# EAGLE schematic AUDIOMOTH (EAGLE 9.2.1)
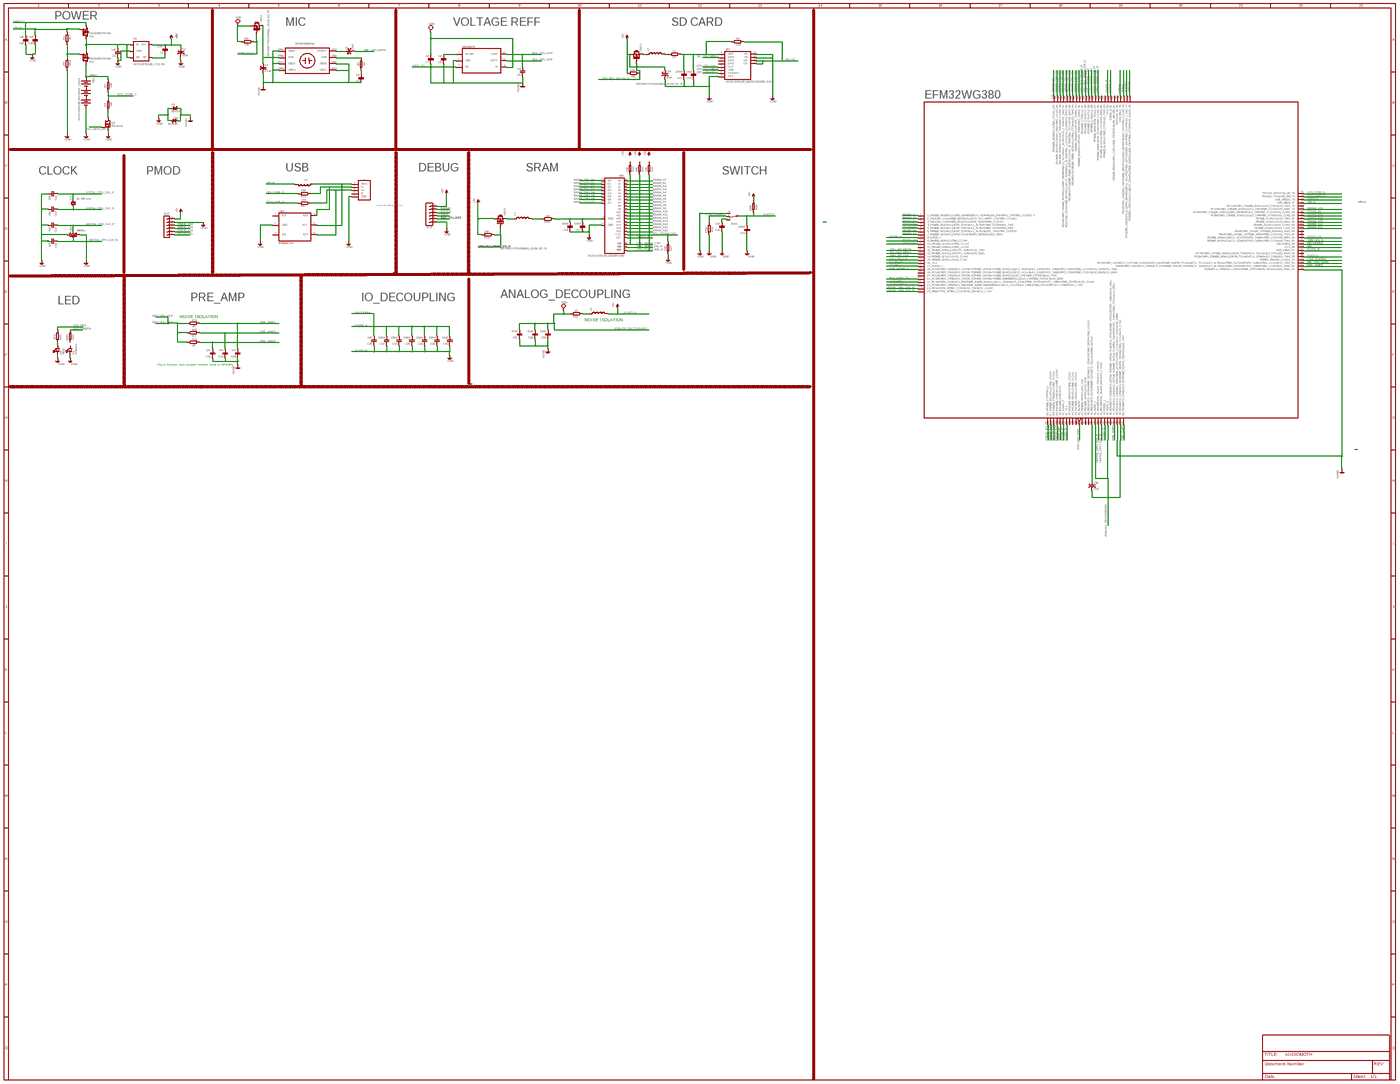
[diagram p0: schematic, sheet 1, overview]
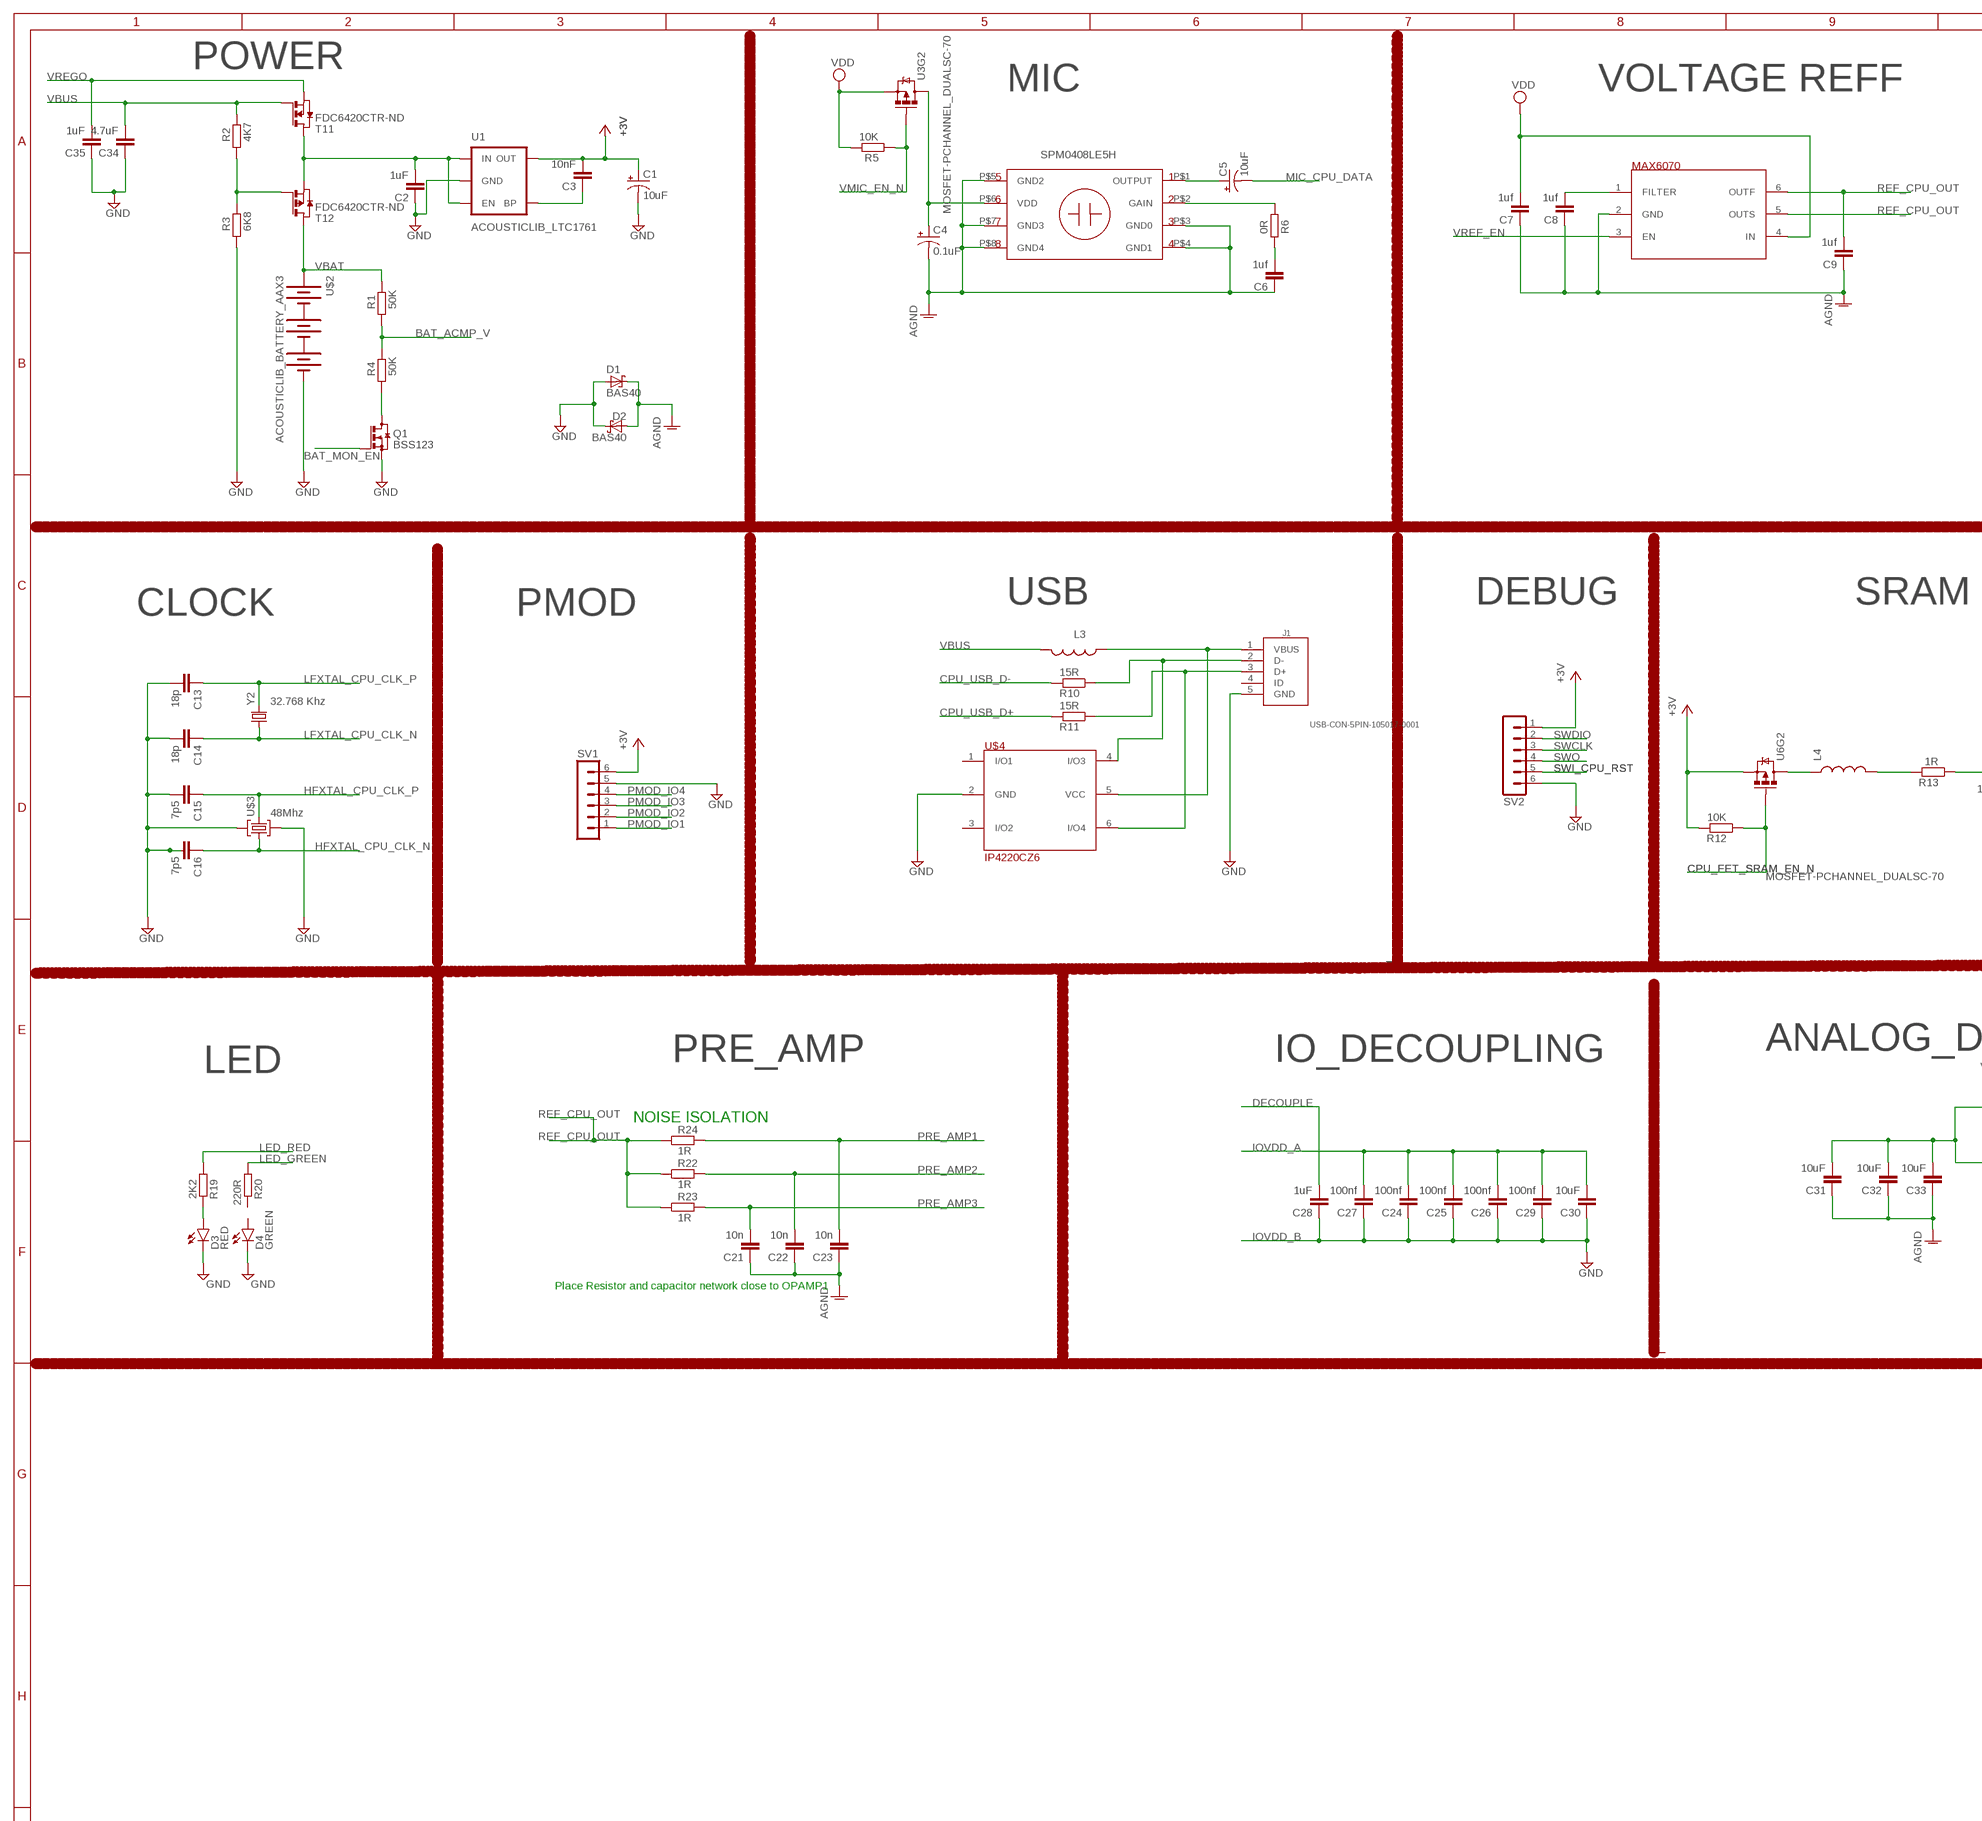
[diagram p1: schematic, sheet 1, part 1 of 6]
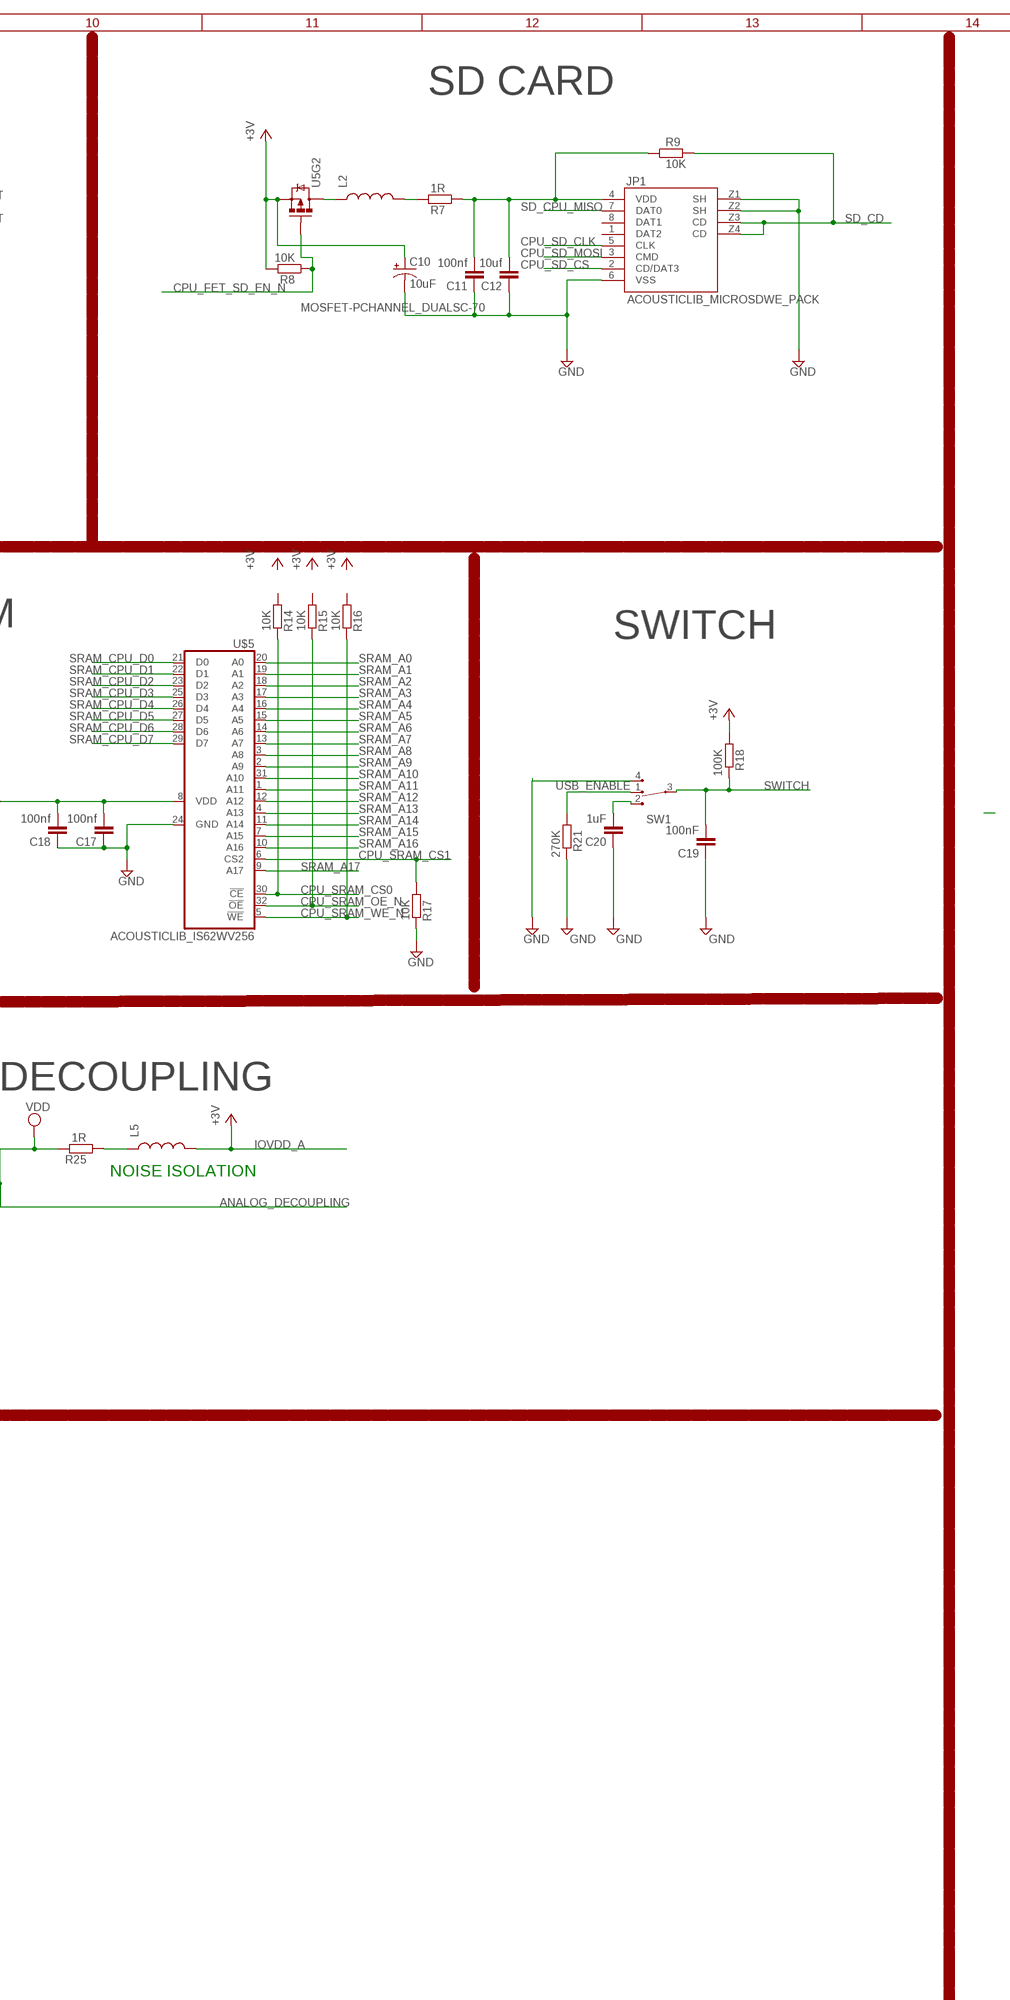
[diagram p2: schematic, sheet 1, part 2 of 6]
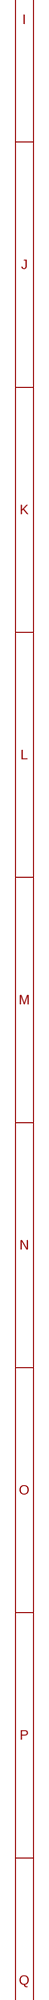
[diagram p3: schematic, sheet 1, part 3 of 6]
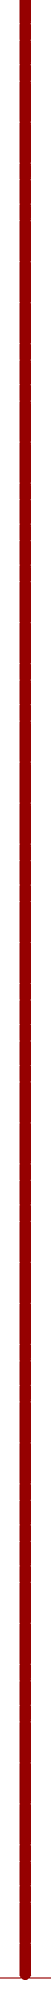
[diagram p4: schematic, sheet 1, part 4 of 6]
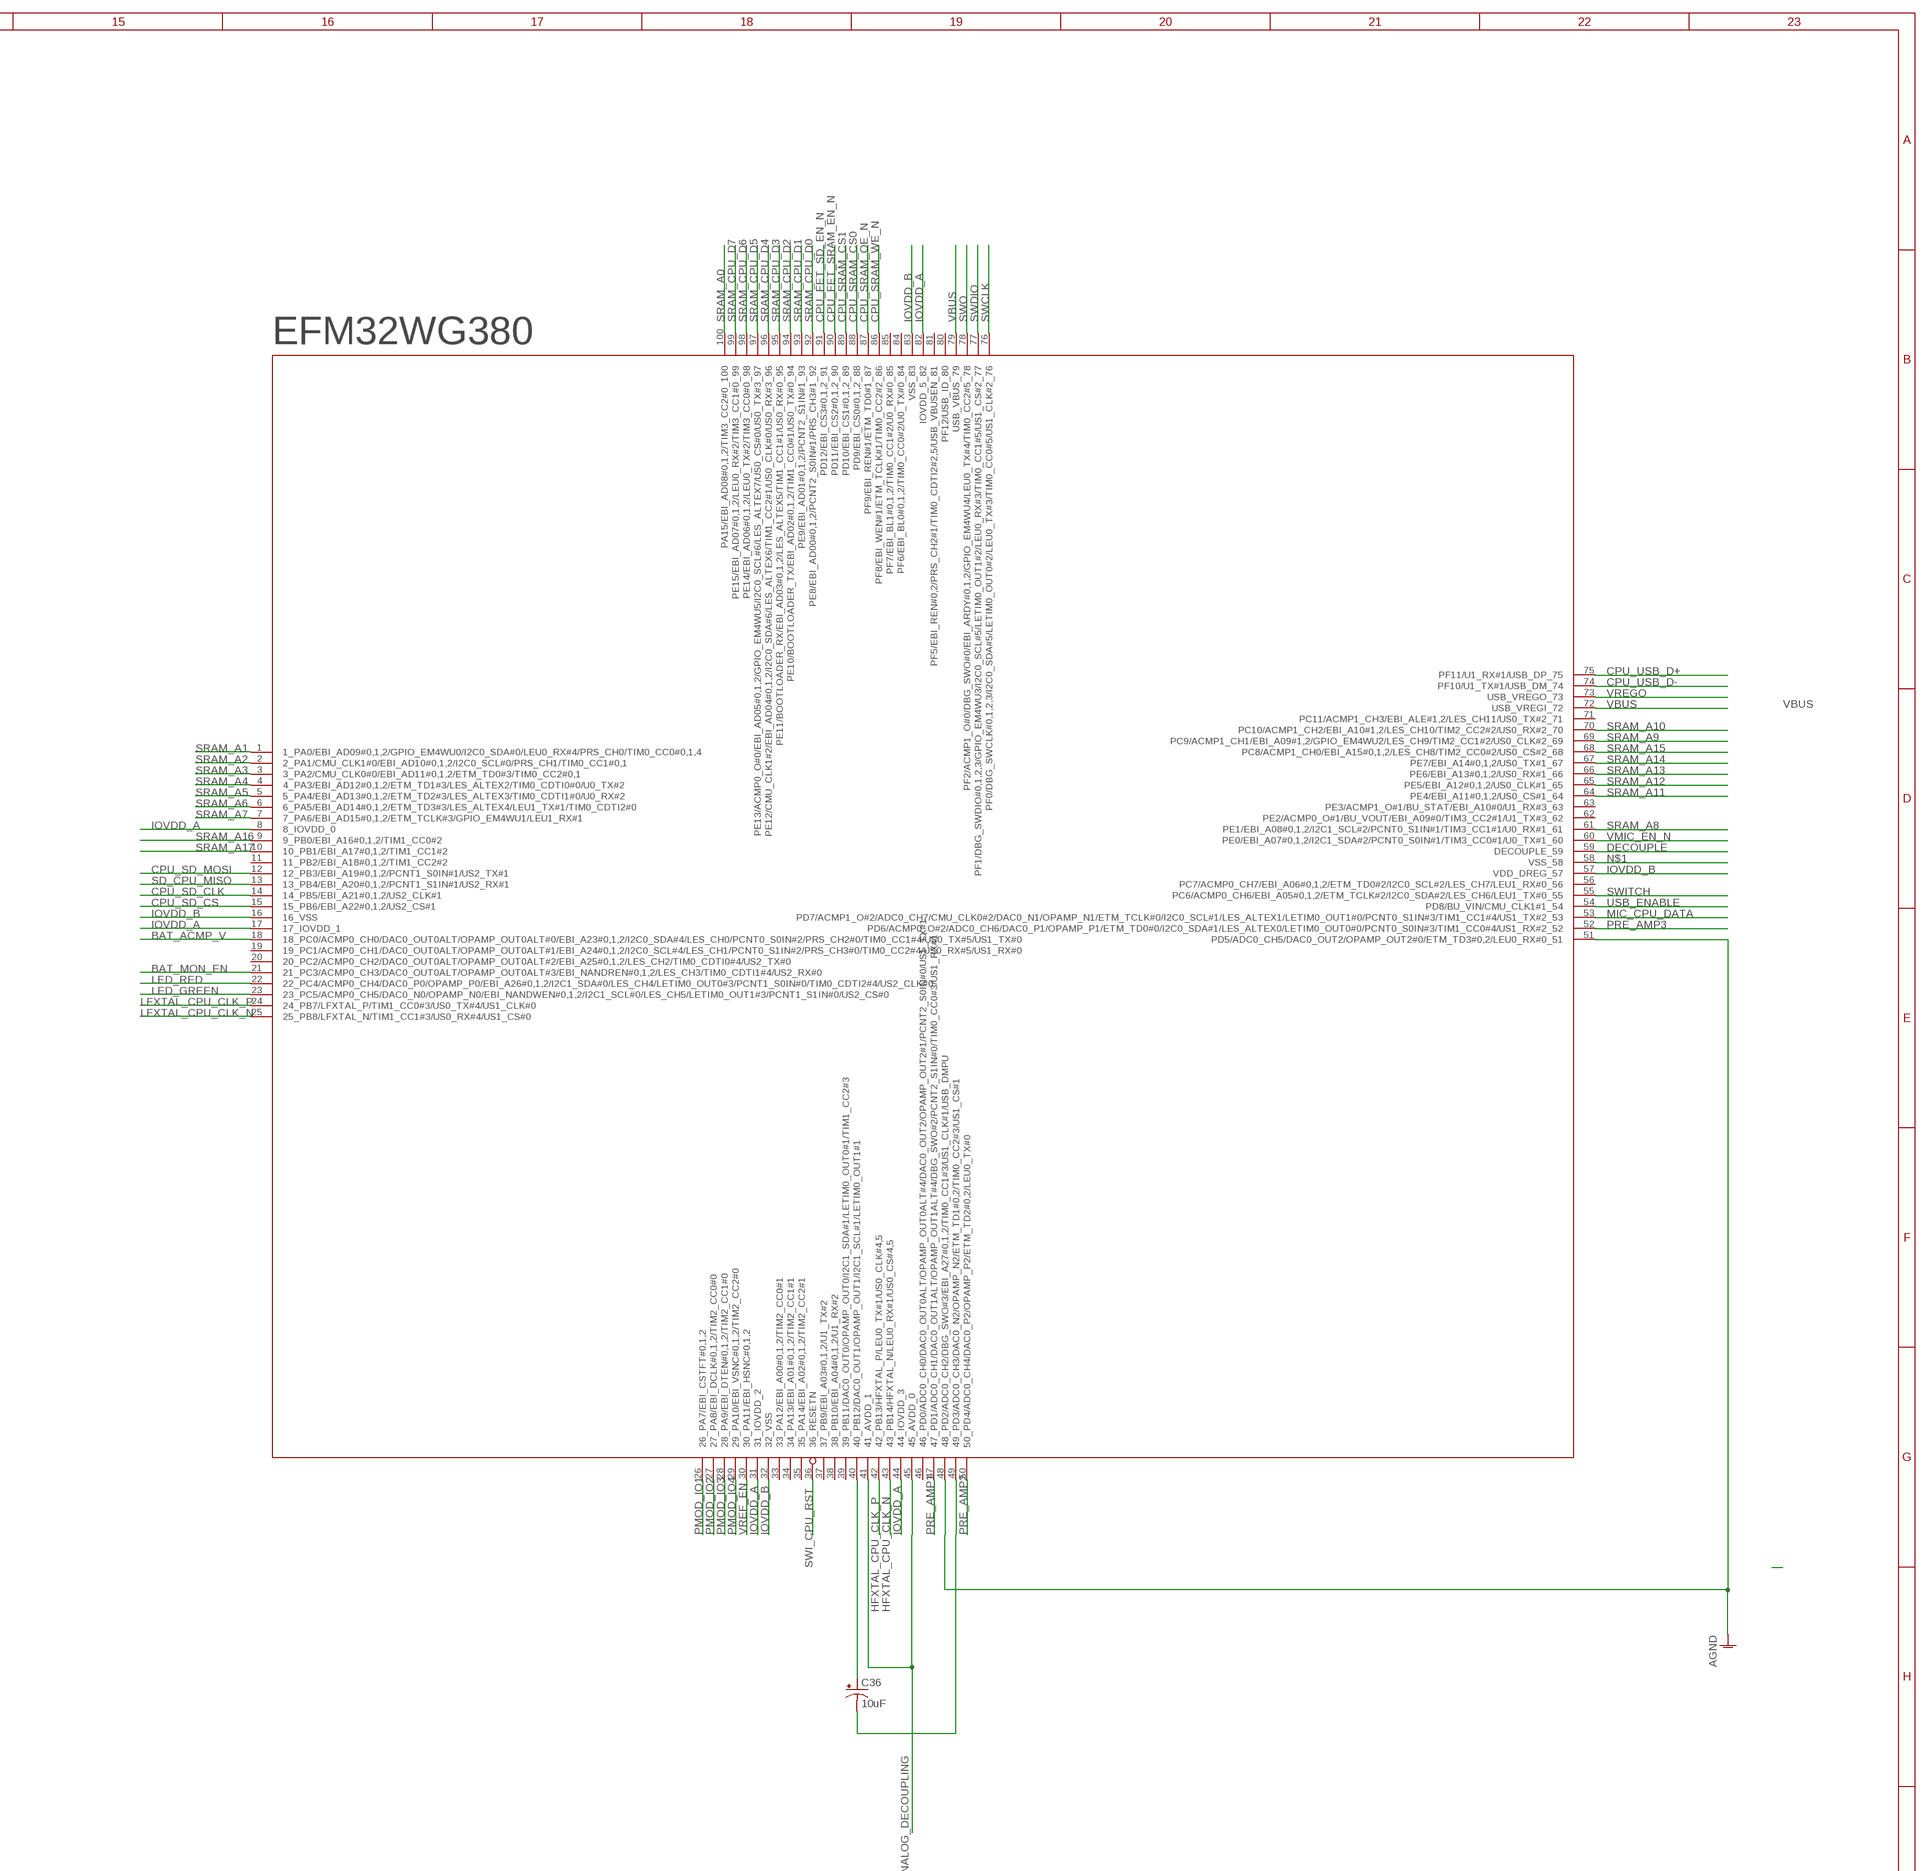
[diagram p5: schematic, sheet 1, part 5 of 6]
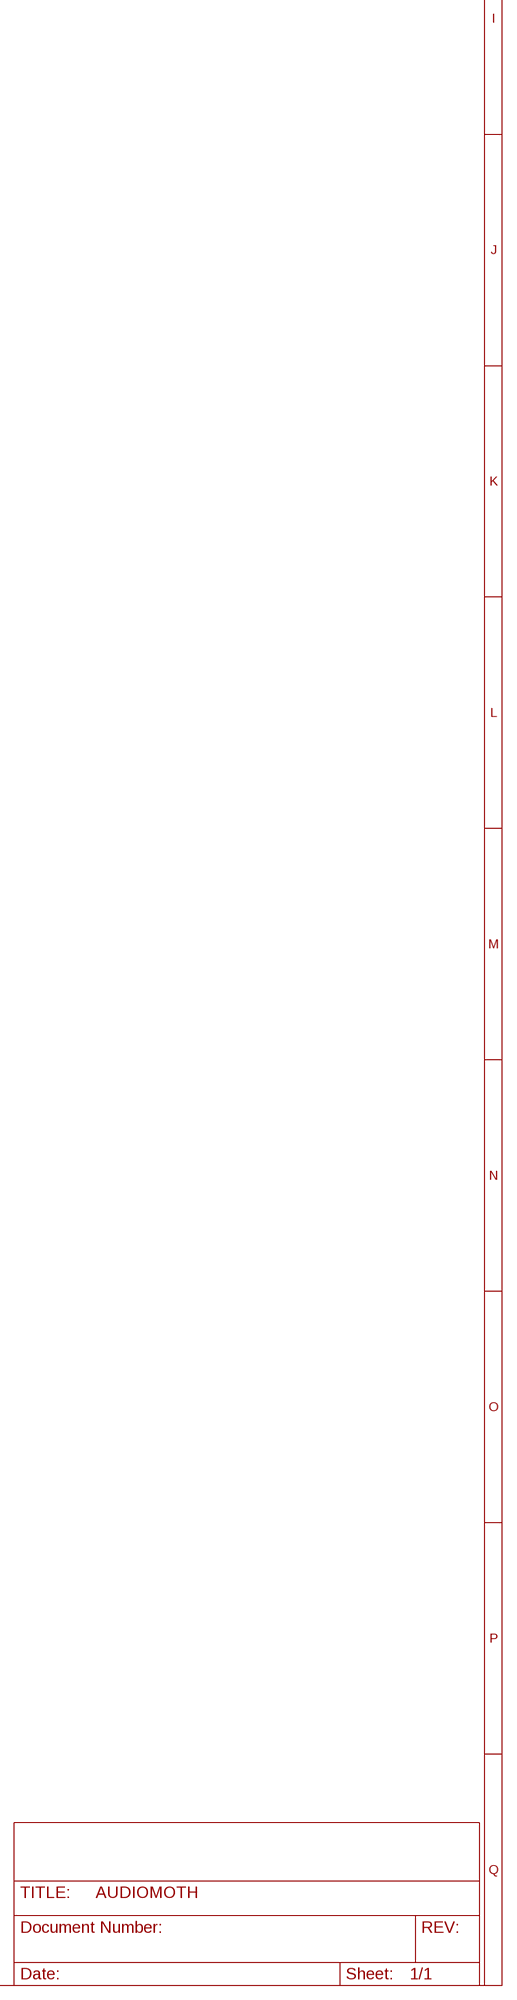
[diagram p6: schematic, sheet 1, part 6 of 6]

## Parts
C1  10uF  SPARKFUN-PASSIVES_CAP_POL1206  [SPARKFUN-PASSIVES_EIA3216]
C2  1uF  SPARKFUN-CAPACITORS_CAP0805  [SPARKFUN-CAPACITORS_0805]
C3  10nF  SPARKFUN-CAPACITORS_CAP0805  [SPARKFUN-CAPACITORS_0805]
C4  0.1uF  SPARKFUN-PASSIVES_CAP_POL1206  [SPARKFUN-PASSIVES_EIA3216]
C5  10uF  SPARKFUN-PASSIVES_CAP_POL1206  [SPARKFUN-PASSIVES_EIA3216]
C6  1uf  SPARKFUN-CAPACITORS_CAP0805  [SPARKFUN-CAPACITORS_0805]
C7  1uf  SPARKFUN-CAPACITORS_CAP0805  [SPARKFUN-CAPACITORS_0805]
C8  1uf  SPARKFUN-CAPACITORS_CAP0805  [SPARKFUN-CAPACITORS_0805]
C9  1uf  SPARKFUN-CAPACITORS_CAP0805  [SPARKFUN-CAPACITORS_0805]
C10  10uF  SPARKFUN-PASSIVES_CAP_POL1206  [SPARKFUN-PASSIVES_EIA3216]
C11  100nf  SPARKFUN-CAPACITORS_CAP0805  [SPARKFUN-CAPACITORS_0805]
C12  10uf  SPARKFUN-CAPACITORS_CAP0805  [SPARKFUN-CAPACITORS_0805]
C13  18p  SPARKFUN-CAPACITORS_CAP0805  [SPARKFUN-CAPACITORS_0805]
C14  18p  SPARKFUN-CAPACITORS_CAP0805  [SPARKFUN-CAPACITORS_0805]
C15  7p5  SPARKFUN-CAPACITORS_CAP0805  [SPARKFUN-CAPACITORS_0805]
C16  7p5  SPARKFUN-CAPACITORS_CAP0805  [SPARKFUN-CAPACITORS_0805]
C17  100nf  SPARKFUN-CAPACITORS_CAP0805  [SPARKFUN-CAPACITORS_0805]
C18  100nf  SPARKFUN-CAPACITORS_CAP0805  [SPARKFUN-CAPACITORS_0805]
C19  100nF  SPARKFUN-CAPACITORS_CAP0805  [SPARKFUN-CAPACITORS_0805]
C20  1uF  SPARKFUN-CAPACITORS_CAP0805  [SPARKFUN-CAPACITORS_0805]
C21  10n  SPARKFUN-CAPACITORS_CAP0805  [SPARKFUN-CAPACITORS_0805]
C22  10n  SPARKFUN-CAPACITORS_CAP0805  [SPARKFUN-CAPACITORS_0805]
C23  10n  SPARKFUN-CAPACITORS_CAP0805  [SPARKFUN-CAPACITORS_0805]
C24  100nf  SPARKFUN-CAPACITORS_CAP0805  [SPARKFUN-CAPACITORS_0805]
C25  100nf  SPARKFUN-CAPACITORS_CAP0805  [SPARKFUN-CAPACITORS_0805]
C26  100nf  SPARKFUN-CAPACITORS_CAP0805  [SPARKFUN-CAPACITORS_0805]
C27  100nf  SPARKFUN-CAPACITORS_CAP0805  [SPARKFUN-CAPACITORS_0805]
C28  1uF  SPARKFUN-CAPACITORS_CAP0805  [SPARKFUN-CAPACITORS_0805]
C29  100nf  SPARKFUN-CAPACITORS_CAP0805  [SPARKFUN-CAPACITORS_0805]
C30  10uF  SPARKFUN-CAPACITORS_CAP0805  [SPARKFUN-CAPACITORS_0805]
C31  10uF  SPARKFUN-CAPACITORS_CAP0805  [SPARKFUN-CAPACITORS_0805]
C32  10uF  SPARKFUN-CAPACITORS_CAP0805  [SPARKFUN-CAPACITORS_0805]
C33  10uF  SPARKFUN-CAPACITORS_CAP0805  [SPARKFUN-CAPACITORS_0805]
C34  4.7uF  SPARKFUN-CAPACITORS_CAP0805  [SPARKFUN-CAPACITORS_0805]
C35  1uF  SPARKFUN-CAPACITORS_CAP0805  [SPARKFUN-CAPACITORS_0805]
C36  10uF  SPARKFUN-PASSIVES_CAP_POL1206  [SPARKFUN-PASSIVES_EIA3216]
D1  BAS40  [SOT23]
D2  BAS40  [SOT23]
D3  RED  SPARKFUN-LED_LED1206  [SPARKFUN-LED_LED-1206]
D4  GREEN  SPARKFUN-LED_LED1206  [SPARKFUN-LED_LED-1206]
J1  USB-CON-5PIN-105017-0001  GEEKAMMO_USB-CON-5PIN-105017-0001  [GEEKAMMO_USB-MICRO-MOLEX-105017-0001]
JP1  ACOUSTICLIB_MICROSDWE_PACK  [ACOUSTICLIB_693071010811]
L2  SPARKFUN-PASSIVES_INDUCTOR0805  [SPARKFUN-PASSIVES_0805]
L3  SPARKFUN-PASSIVES_INDUCTOR0805  [SPARKFUN-PASSIVES_0805]
L4  SPARKFUN-PASSIVES_INDUCTOR0805  [SPARKFUN-PASSIVES_0805]
L5  SPARKFUN-PASSIVES_INDUCTOR0805  [SPARKFUN-PASSIVES_0805]
Q1  BSS123  [SOT23]
R1  50K  R-EU_M0805  [M0805]
R2  4K7  R-EU_M0805  [M0805]
R3  6K8  R-EU_M0805  [M0805]
R4  50K  R-EU_M0805  [M0805]
R5  10K  R-EU_M0805  [M0805]
R6  0R  R-EU_M0805  [M0805]
R7  1R  R-EU_M0805  [M0805]
R8  10K  R-EU_M0805  [M0805]
R9  10K  R-EU_M0805  [M0805]
R10  15R  R-EU_M0805  [M0805]
R11  15R  R-EU_M0805  [M0805]
R12  10K  R-EU_M0805  [M0805]
R13  1R  R-EU_M0805  [M0805]
R14  10K  R-EU_M0805  [M0805]
R15  10K  R-EU_M0805  [M0805]
R16  10K  R-EU_M0805  [M0805]
R17  10K  R-EU_M0805  [M0805]
R18  100K  R-EU_M0805  [M0805]
R19  2K2  R-EU_M0805  [M0805]
R20  220R  R-EU_M0805  [M0805]
R21  270K  R-EU_M0805  [M0805]
R22  1R  R-EU_M0805  [M0805]
R23  1R  R-EU_M0805  [M0805]
R24  1R  R-EU_M0805  [M0805]
R25  1R  R-EU_M0805  [M0805]
SV1  ACOUSTICLIB_MA06-1RIGHT_ANGLE  [ACOUSTICLIB_MA06-1W]
SV2  ACOUSTICLIB_MA06-1RIGHT_ANGLE  [ACOUSTICLIB_MA06-1W]
SW1  CT10-XXXX-CSS131  [CT10-XXXX-G4]
T1  FDC6420CTR-ND  ZETEX_PN_MOSFET-  [ZETEX_SOT23-6]
U1  ACOUSTICLIB_LTC1761  [ACOUSTICLIB_SOT23-5]
U2  ACOUSTICLIB_SPM0408LE5H  [ACOUSTICLIB_SPM0408LE5H-TB]
U3  MOSFET-PCHANNEL_DUALSC-70  ACOUSTICLIB_MOSFET-PCHANNEL_DUALSC-70  [ACOUSTICLIB_SC-70]
U4  ACOUSTICLIB_MAX6070SOT23  [ACOUSTICLIB_SOT26]
U5  MOSFET-PCHANNEL_DUALSC-70  ACOUSTICLIB_MOSFET-PCHANNEL_DUALSC-70  [ACOUSTICLIB_SC-70]
U6  MOSFET-PCHANNEL_DUALSC-70  ACOUSTICLIB_MOSFET-PCHANNEL_DUALSC-70  [ACOUSTICLIB_SC-70]
U$1  EFM32_QGP100  [EFM32_QFP100]
U$2  ACOUSTICLIB_BATTERY_AAX3  [ACOUSTICLIB_BATTERY-AAX3]
U$3  ACOUSTICLIB_XRCGB48M000F4M00R0  [ACOUSTICLIB_XRCGB48M000F4M00R0]
U$4  ACOUSTICLIB_IP4220CZ6  [ACOUSTICLIB_SC-74]
U$5  ACOUSTICLIB_IS62WV256  [ACOUSTICLIB_IS62WV256]
Y2  ACOUSTICLIB_CRYSTALEPSONMC146  [ACOUSTICLIB_CRYSTAL-32KHZ-SMD_EPSON_MC146]

## Nets
+3V2: C1.A(+) C3.2 C10.A(+) R8.2 U1.5(OUT) U5.4(S)
+3V3: R12.2 R18.1 SV1.6 SV2.1 U6.4(S)
AGND: C4.C(-) C6.1 C7.1 C8.1 C9.1 C21.1 C22.1 C23.1 C31.1 C32.1 C33.1 D1.3(C) D2.1(A) U2.P$3(GND0) U2.P$4(GND1) U2.P$5(GND2) U2.P$7(GND3) U2.P$8(GND4) U4.2(GND) U$1.48(48_PD2/ADC0_CH2/DBG_SWO#3/EBI_A27#0,1,2/TIM0_CC1#3/US1_CLK#1/USB_DMPU) U$1.51(PD5/ADC0_CH5/DAC0_OUT2/OPAMP_OUT2#0/ETM_TD3#0,2/LEU0_RX#0_51)
ANALOG_DECOUPLING: C31.2 C32.2 C33.2 R25.2 U$1.41(41_AVDD_1) U$1.45(45_AVDD_0) ; supply symbol labelled VDD
BAT_ACMP_V: R1.1 R4.2 U$1.18(18_PC0/ACMP0_CH0/DAC0_OUT0ALT/OPAMP_OUT0ALT#0/EBI_A23#0,1,2/I2C0_SDA#4/LES_CH0/PCNT0_S0IN#2/PRS_CH2#0/TIM0_CC1#4/US0_TX#5/US1_TX#0)
BAT_MON_EN: Q1.1(G) U$1.21(21_PC3/ACMP0_CH3/DAC0_OUT0ALT/OPAMP_OUT0ALT#3/EBI_NANDREN#0,1,2/LES_CH3/TIM0_CDTI1#4/US2_RX#0)
CPU_FET_SD_EN_N: R8.1 U5.5(G) U$1.91(PD12/EBI_CS3#0,1,2_91)
CPU_FET_SRAM_EN_N: R12.1 U6.5(G) U$1.90(PD11/EBI_CS2#0,1,2_90)
CPU_SD_CLK: JP1.5(CLK) U$1.14(14_PB5/EBI_A21#0,1,2/US2_CLK#1)
CPU_SD_CS: JP1.2(CD/DAT3) U$1.15(15_PB6/EBI_A22#0,1,2/US2_CS#1)
CPU_SD_MOSI: JP1.3(CMD) U$1.12(12_PB3/EBI_A19#0,1,2/PCNT1_S0IN#1/US2_TX#1)
CPU_SRAM_CS0: R14.2 U$1.88(PD9/EBI_CS0#0,1,2_88) U$5.30(!CE)
CPU_SRAM_CS1: R17.1 U$1.89(PD10/EBI_CS1#0,1,2_89) U$5.6(CS2)
CPU_SRAM_OE_N: R15.2 U$1.87(PF9/EBI_REN#1/ETM_TD0#1_87) U$5.32(!OE)
CPU_SRAM_WE_N: R16.2 U$1.86(PF8/EBI_WEN#1/ETM_TCLK#1/TIM0_CC2#2_86) U$5.5(!WE)
CPU_USB_D+: R11.2 U$1.75(PF11/U1_RX#1/USB_DP_75)
CPU_USB_D-: R10.2 U$1.74(PF10/U1_TX#1/USB_DM_74)
DECOUPLE: C28.2 U$1.59(DECOUPLE_59)
GND: C1.C(-) C2.1 C10.C(-) C11.1 C12.1 C13.2 C14.2 C15.2 C16.2 C17.1 C18.1 C19.1 C20.1 C34.1 C35.1 D1.1(A) D2.3(C) D3.C D4.C J1.5(GND) JP1.6(VSS) JP1.Z1(SH) JP1.Z2(SH) Q1.2(S) R3.1 R17.2 R21.2 SV1.5 SV2.6 SW1.4 U1.2(GND) U$2.GND@2(-) U$3.P$2 U$3.P$4 U$4.2(GND) U$5.24(GND)
HFXTAL_CPU_CLK_N: C16.1 U$1.43(43_PB14/HFXTAL_N/LEU0_RX#1/US0_CS#4,5) U$3.P$1
HFXTAL_CPU_CLK_P: C15.1 U$1.42(42_PB13/HFXTAL_P/LEU0_TX#1/US0_CLK#4,5) U$3.P$3
IOVDD_A: C24.2 C25.2 C26.2 C27.2 C29.2 C30.2 L5.2 U$1.8(8_IOVDD_0) U$1.17(17_IOVDD_1) U$1.31(31_IOVDD_2) U$1.44(44_IOVDD_3) U$1.82(IOVDD_5_82)
IOVDD_B: C24.1 C25.1 C26.1 C27.1 C28.1 C29.1 C30.1 U$1.16(16_VSS) U$1.32(32_VSS) U$1.57(VDD_DREG_57) U$1.83(VSS_83) ; supply symbol labelled GND
LED_GREEN: R20.1 U$1.23(23_PC5/ACMP0_CH5/DAC0_N0/OPAMP_N0/EBI_NANDWEN#0,1,2/I2C1_SCL#0/LES_CH5/LETIM0_OUT1#3/PCNT1_S1IN#0/US2_CS#0)
LED_RED: R19.1 U$1.22(22_PC4/ACMP0_CH4/DAC0_P0/OPAMP_P0/EBI_A26#0,1,2/I2C1_SDA#0/LES_CH4/LETIM0_OUT0#3/PCNT1_S0IN#0/TIM0_CDTI2#4/US2_CLK#0)
LFXTAL_CPU_CLK_N: C14.1 U$1.25(25_PB8/LFXTAL_N/TIM1_CC1#3/US0_RX#4/US1_CS#0) Y2.P$2
LFXTAL_CPU_CLK_P: C13.1 U$1.24(24_PB7/LFXTAL_P/TIM1_CC0#3/US0_TX#4/US1_CLK#0) Y2.P$1
MIC_CPU_DATA: C5.C(-) U$1.53(PD7/ACMP1_O#2/ADC0_CH7/CMU_CLK0#2/DAC0_N1/OPAMP_N1/ETM_TCLK#0/I2C0_SCL#1/LES_ALTEX1/LETIM0_OUT1#0/PCNT0_S1IN#3/TIM1_CC1#4/US1_TX#2_53)
N$1: U$1.58(VSS_58)
N$3: R2.1 R3.2 T1.3(2:G)
N$4: C2.2 T1.2(2:S) T1.6(1:D) U1.1(IN) U1.3(EN)
N$6: C3.1 U1.4(BP)
N$7: Q1.3(D) R4.1
N$10: C4.A(+) U2.P$6(VDD) U3.3(D)
N$11: C5.A(+) U2.P$1(OUTPUT)
N$13: R6.1 U2.P$2(GAIN)
N$14: C6.2 R6.2
N$16: C8.2 U4.1(FILTER)
N$20: L2.1 U5.3(D)
N$28: L2.2 R7.2
N$29: C11.2 C12.2 JP1.4(VDD) R7.1 R9.1
N$36: J1.1(VBUS) L3.1 U$4.5(VCC)
N$38: J1.2(D-) R10.1 U$4.4(I/O3)
N$40: J1.3(D+) R11.1 U$4.6(I/O4)
N$76: D3.A R19.2
N$78: L4.1 U6.3(D)
N$79: L4.2 R13.2
N$80: C17.2 C18.2 R13.1 U$5.8(VDD)
N$85: C20.2 SW1.2
N$91: L5.1 R25.1
N$109: C36.C(-) U$1.49(49_PD3/ADC0_CH3/DAC0_N2/OPAMP_N2/ETM_TD1#0,2/TIM0_CC2#3/US1_CS#1)
OPAMP1_OPAMP2_DATA: C36.A(+) U$1.40(40_PB12/DAC0_OUT1/OPAMP_OUT1/I2C1_SCL#1/LETIM0_OUT1#1)
PMOD_IO1: SV1.1 U$1.26(26_PA7/EBI_CSTFT#0,1,2)
PMOD_IO2: SV1.2 U$1.27(27_PA8/EBI_DCLK#0,1,2/TIM2_CC0#0)
PMOD_IO3: SV1.3 U$1.28(28_PA9/EBI_DTEN#0,1,2/TIM2_CC1#0)
PMOD_IO4: SV1.4 U$1.29(29_PA10/EBI_VSNC#0,1,2/TIM2_CC2#0)
PRE_AMP1: C23.2 R24.2 U$1.47(47_PD1/ADC0_CH1/DAC0_OUT1ALT/OPAMP_OUT1ALT#4/DBG_SWO#2/PCNT2_S1IN#0/TIM0_CC0#3/US1_RX#1)
PRE_AMP2: C22.2 R22.2 U$1.50(50_PD4/ADC0_CH4/DAC0_P2/OPAMP_P2/ETM_TD2#0,2/LEU0_TX#0)
PRE_AMP3: C21.2 R23.2 U$1.52(PD6/ACMP0_O#2/ADC0_CH6/DAC0_P1/OPAMP_P1/ETM_TD0#0/I2C0_SDA#1/LES_ALTEX0/LETIM0_OUT0#0/PCNT0_S0IN#3/TIM1_CC0#4/US1_RX#2_52)
REF_CPU_OUT: C9.2 R22.1 R23.1 R24.1 U4.5(OUTS) U4.6(OUTF)
SD_CD: JP1.Z3(CD) JP1.Z4(CD) R9.2
SD_CPU_MISO: JP1.7(DAT0) U$1.13(13_PB4/EBI_A20#0,1,2/PCNT1_S1IN#1/US2_RX#1)
SRAM_A0: U$1.100(PA15/EBI_AD08#0,1,2/TIM3_CC2#0_100) U$5.20(A0)
SRAM_A1: U$1.1(1_PA0/EBI_AD09#0,1,2/GPIO_EM4WU0/I2C0_SDA#0/LEU0_RX#4/PRS_CH0/TIM0_CC0#0,1,4) U$5.19(A1)
SRAM_A2: U$1.2(2_PA1/CMU_CLK1#0/EBI_AD10#0,1,2/I2C0_SCL#0/PRS_CH1/TIM0_CC1#0,1) U$5.18(A2)
SRAM_A3: U$1.3(3_PA2/CMU_CLK0#0/EBI_AD11#0,1,2/ETM_TD0#3/TIM0_CC2#0,1) U$5.17(A3)
SRAM_A4: U$1.4(4_PA3/EBI_AD12#0,1,2/ETM_TD1#3/LES_ALTEX2/TIM0_CDTI0#0/U0_TX#2) U$5.16(A4)
SRAM_A5: U$1.5(5_PA4/EBI_AD13#0,1,2/ETM_TD2#3/LES_ALTEX3/TIM0_CDTI1#0/U0_RX#2) U$5.15(A5)
SRAM_A6: U$1.6(6_PA5/EBI_AD14#0,1,2/ETM_TD3#3/LES_ALTEX4/LEU1_TX#1/TIM0_CDTI2#0) U$5.14(A6)
SRAM_A7: U$1.7(7_PA6/EBI_AD15#0,1,2/ETM_TCLK#3/GPIO_EM4WU1/LEU1_RX#1) U$5.13(A7)
SRAM_A8: U$1.61(PE1/EBI_A08#0,1,2/I2C1_SCL#2/PCNT0_S1IN#1/TIM3_CC1#1/U0_RX#1_61) U$5.3(A8)
SRAM_A9: U$1.69(PC9/ACMP1_CH1/EBI_A09#1,2/GPIO_EM4WU2/LES_CH9/TIM2_CC1#2/US0_CLK#2_69) U$5.2(A9)
SRAM_A10: U$1.70(PC10/ACMP1_CH2/EBI_A10#1,2/LES_CH10/TIM2_CC2#2/US0_RX#2_70) U$5.31(A10)
SRAM_A11: U$1.64(PE4/EBI_A11#0,1,2/US0_CS#1_64) U$5.1(A11)
SRAM_A12: U$1.65(PE5/EBI_A12#0,1,2/US0_CLK#1_65) U$5.12(A12)
SRAM_A13: U$1.66(PE6/EBI_A13#0,1,2/US0_RX#1_66) U$5.4(A13)
SRAM_A14: U$1.67(PE7/EBI_A14#0,1,2/US0_TX#1_67) U$5.11(A14)
SRAM_A15: U$1.68(PC8/ACMP1_CH0/EBI_A15#0,1,2/LES_CH8/TIM2_CC0#2/US0_CS#2_68) U$5.7(A15)
SRAM_A16: U$1.9(9_PB0/EBI_A16#0,1,2/TIM1_CC0#2) U$5.10(A16)
SRAM_A17: U$1.10(10_PB1/EBI_A17#0,1,2/TIM1_CC1#2) U$5.9(A17)
SRAM_CPU_D0: U$1.92(PE8/EBI_AD00#0,1,2/PCNT2_S0IN#1/PRS_CH3#1_92) U$5.21(D0)
SRAM_CPU_D1: U$1.93(PE9/EBI_AD01#0,1,2/PCNT2_S1IN#1_93) U$5.22(D1)
SRAM_CPU_D2: U$1.94(PE10/BOOTLOADER_TX/EBI_AD02#0,1,2/TIM1_CC0#1/US0_TX#0_94) U$5.23(D2)
SRAM_CPU_D3: U$1.95(PE11/BOOTLOADER_RX/EBI_AD03#0,1,2/LES_ALTEX5/TIM1_CC1#1/US0_RX#0_95) U$5.25(D3)
SRAM_CPU_D4: U$1.96(PE12/CMU_CLK1#2/EBI_AD04#0,1,2/I2C0_SDA#6/LES_ALTEX6/TIM1_CC2#1/US0_CLK#0/US0_RX#3_96) U$5.26(D4)
SRAM_CPU_D5: U$1.97(PE13/ACMP0_O#0/EBI_AD05#0,1,2/GPIO_EM4WU5/I2C0_SCL#6/LES_ALTEX7/US0_CS#0/US0_TX#3_97) U$5.27(D5)
SRAM_CPU_D6: U$1.98(PE14/EBI_AD06#0,1,2/LEU0_TX#2/TIM3_CC0#0_98) U$5.28(D6)
SRAM_CPU_D7: U$1.99(PE15/EBI_AD07#0,1,2/LEU0_RX#2/TIM3_CC1#0_99) U$5.29(D7)
SWCLK: SV2.3 U$1.76(PF0/DBG_SWCLK#0,1,2,3/I2C0_SDA#5/LETIM0_OUT0#2/LEU0_TX#3/TIM0_CC0#5/US1_CLK#2_76)
SWDIO: SV2.2 U$1.77(PF1/DBG_SWDIO#0,1,2,3/GPIO_EM4WU3/I2C0_SCL#5/LETIM0_OUT1#2/LEU0_RX#3/TIM0_CC1#5/US1_CS#2_77)
SWI_CPU_RST: SV2.5 U$1.36(36_RESETN)
SWITCH: C19.2 R18.2 SW1.3 U$1.55(PC6/ACMP0_CH6/EBI_A05#0,1,2/ETM_TCLK#2/I2C0_SDA#2/LES_CH6/LEU1_TX#0_55)
SWO: SV2.4 U$1.78(PF2/ACMP1_O#0/DBG_SWO#0/EBI_ARDY#0,1,2/GPIO_EM4WU4/LEU0_TX#4/TIM0_CC2#5_78)
USB_ENABLE: R21.1 SW1.1 U$1.54(PD8/BU_VIN/CMU_CLK1#1_54)
VBAT: R1.2 T1.4(2:D) U$2.PWR@1(+)
VBUS: C34.2 L3.2 R2.2 T1.1(1:G) U$1.72(USB_VREGI_72) U$1.79(USB_VBUS_79)
VDD: C7.2 R5.2 U3.4(S) U4.4(IN)
VMIC_EN_N: R5.1 U3.5(G) U$1.60(PE0/EBI_A07#0,1,2/I2C1_SDA#2/PCNT0_S0IN#1/TIM3_CC0#1/U0_TX#1_60)
VREF_EN: U4.3(EN) U$1.30(30_PA11/EBI_HSNC#0,1,2)
VREGO: C35.2 T1.5(1:S) U$1.73(USB_VREGO_73)
Unconnected: D4.A J1.4(ID) JP1.1(DAT2) JP1.8(DAT1) R14.1 R15.1 R16.1 R20.2 U3.1(S) U3.2(G) U3.6(D) U5.1(S) U5.2(G) U5.6(D) U6.1(S) U6.2(G) U6.6(D) U$1.11(11_PB2/EBI_A18#0,1,2/TIM1_CC2#2) U$1.19(19_PC1/ACMP0_CH1/DAC0_OUT0ALT/OPAMP_OUT0ALT#1/EBI_A24#0,1,2/I2C0_SCL#4/LES_CH1/PCNT0_S1IN#2/PRS_CH3#0/TIM0_CC2#4/US0_RX#5/US1_RX#0) U$1.20(20_PC2/ACMP0_CH2/DAC0_OUT0ALT/OPAMP_OUT0ALT#2/EBI_A25#0,1,2/LES_CH2/TIM0_CDTI0#4/US2_TX#0) U$1.33(33_PA12/EBI_A00#0,1,2/TIM2_CC0#1) U$1.34(34_PA13/EBI_A01#0,1,2/TIM2_CC1#1) U$1.35(35_PA14/EBI_A02#0,1,2/TIM2_CC2#1) U$1.37(37_PB9/EBI_A03#0,1,2/U1_TX#2) U$1.38(38_PB10/EBI_A04#0,1,2/U1_RX#2) U$1.39(39_PB11/DAC0_OUT0/OPAMP_OUT0/I2C1_SDA#1/LETIM0_OUT0#1/TIM1_CC2#3) U$1.46(46_PD0/ADC0_CH0/DAC0_OUT0ALT/OPAMP_OUT0ALT#4/DAC0_OUT2/OPAMP_OUT2#1/PCNT2_S0IN#0/US1_TX#1) U$1.56(PC7/ACMP0_CH7/EBI_A06#0,1,2/ETM_TD0#2/I2C0_SCL#2/LES_CH7/LEU1_RX#0_56) U$1.62(PE2/ACMP0_O#1/BU_VOUT/EBI_A09#0/TIM3_CC2#1/U1_TX#3_62) U$1.63(PE3/ACMP1_O#1/BU_STAT/EBI_A10#0/U1_RX#3_63) U$1.71(PC11/ACMP1_CH3/EBI_ALE#1,2/LES_CH11/US0_TX#2_71) U$1.80(PF12/USB_ID_80) U$1.81(PF5/EBI_REN#0,2/PRS_CH2#1/TIM0_CDTI2#2,5/USB_VBUSEN_81) U$1.84(PF6/EBI_BL0#0,1,2/TIM0_CC0#2/U0_TX#0_84) U$1.85(PF7/EBI_BL1#0,1,2/TIM0_CC1#2/U0_RX#0_85) U$4.1(I/O1) U$4.3(I/O2)

## Notes on the sheet
- POWER
- MIC | VOLTAGE REFF | SD CARD
- +3V | +3V | +3V
- SPM0408LE5H
- +3V | +3V | +3V
- CLOCK | PMOD | USB | DEBUG | SRAM | SWITCH
- +3V
- +3V
- 32.768 Khz
- +3V
- +3V
- 48Mhz
- PRE_AMP | IO_DECOUPLING | ANALOG_DECOUPLING
- LED
- +3V
- NOISE ISOLATION
- NOISE ISOLATION
- Place Resistor and capacitor network close to OPAMP1

## Library data of the parts
C1 C4 C5 C10 C36 = AudioMoth - Copy:SPARKFUN-PASSIVES_CAP_POL: Capacitor Polarized These are standard SMD and PTH capacitors. Normally 10uF, 47uF, and 100uF in electrolytic and tantalum varieties. Always verify the external diameter of the through hole cap, it varies with capacity, voltage, and manufacturer. The EIA devices should be standard.
C2 C3 C6-C9 C11-C35 = AudioMoth - Copy:SPARKFUN-CAPACITORS_CAP: Capacitor Standard 0603 ceramic capacitor, and 0.1" leaded capacitor.
D1 D2 = diode:BAS40: Silicon Schottky Diodes General-purpose diode for high-speed switching
D3 D4 = AudioMoth - Copy:SPARKFUN-LED_LED: LEDs Standard schematic elements and footprints for 5mm, 3mm, 1206, and 0603 sized LEDs. 5mm - Spark Fun Electronics SKU : COM-00529 (and others)
J1 = AudioMoth - Copy:GEEKAMMO_USB-CON-5PIN: Molex Micro USB 105017-0001
JP1 = AudioMoth - Copy:ACOUSTICLIB_MICROSD
L2-L5 = AudioMoth - Copy:SPARKFUN-PASSIVES_INDUCTOR: Inductors Basic Inductor/Choke - 0603 and 1206. Footprints are not proven and vary greatly between part numbers. INDUCTOR POWER 3.3UH 4.0A SMD 0.197" L x 0.197" W x 0.177" H (5.00mm x 5.00mm x 4.50mm)
Q1 = transistor-small-signal:BSS123: N-CHANNEL MOS FET
R1-R25 = rcl:R-EU_: RESISTOR, European symbol; SPICEPREFIX: R
SV1 SV2 = AudioMoth - Copy:ACOUSTICLIB_MA06-1: PIN HEADER
SW1 = switch-coto:CT10-XXXX-: CT10 Series Molded Switch Source: www.cotorelay.com .. Coto_Technology__CT10-1530-G1.pdf
T1 = AudioMoth - Copy:ZETEX_PN_MOSFET-: DUAL N AND P-CHANNEL ENHANCEMENT MODE MOSFET Source: Data sheet <http://www.farnell.com/datasheets/1693880.pdf>
U1 = AudioMoth - Copy:ACOUSTICLIB_LTC1761
U2 = AudioMoth - Copy:ACOUSTICLIB_SPM0408LE5H
U3 U5 U6 = AudioMoth - Copy:ACOUSTICLIB_MOSFET-PCHANNEL_DUAL
U4 = AudioMoth - Copy:ACOUSTICLIB_MAX6070
U$1 = AudioMoth - Copy:EFM32_QGP100
U$2 = AudioMoth - Copy:ACOUSTICLIB_BATTERY_AAX3
U$3 = AudioMoth - Copy:ACOUSTICLIB_XRCGB48M000F4M00R0: XRCGB48M000F4M00R0 48MHz Clock
U$4 = AudioMoth - Copy:ACOUSTICLIB_IP4220CZ6: IP4220CZ6 The IP4220CZ6 is designed to protect I/O lines sensitive to capacitive load, such as USB 2.0 http://www.farnell.com/datasheets/1708221.pdf
U$5 = AudioMoth - Copy:ACOUSTICLIB_IS62WV256
Y2 = AudioMoth - Copy:ACOUSTICLIB_CRYSTAL: Various standard crystals. Proven footprints.